# Altium schematic sheet Supply_0_V1_01.SchDoc
size A2; Date: Date; CompanyName: HESSO; Engineer: Name; Address1: Route du Rawyl 47; Address2: 1950 Sion; Address3: Switzerland; ProjectName: Project Name
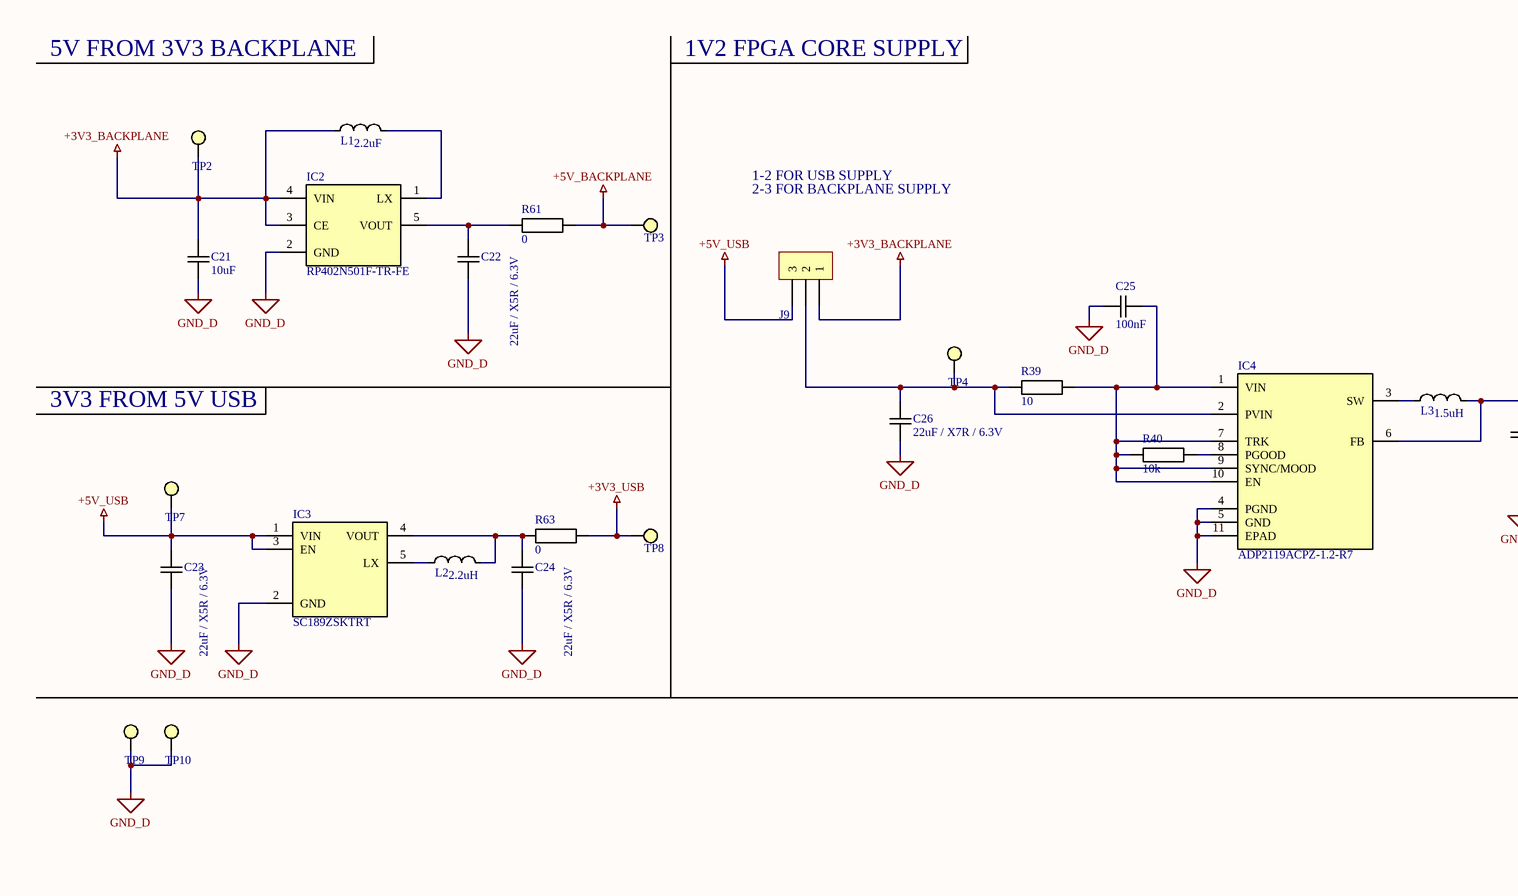
[diagram p0: Supply_0_V1_01.SchDoc, left]
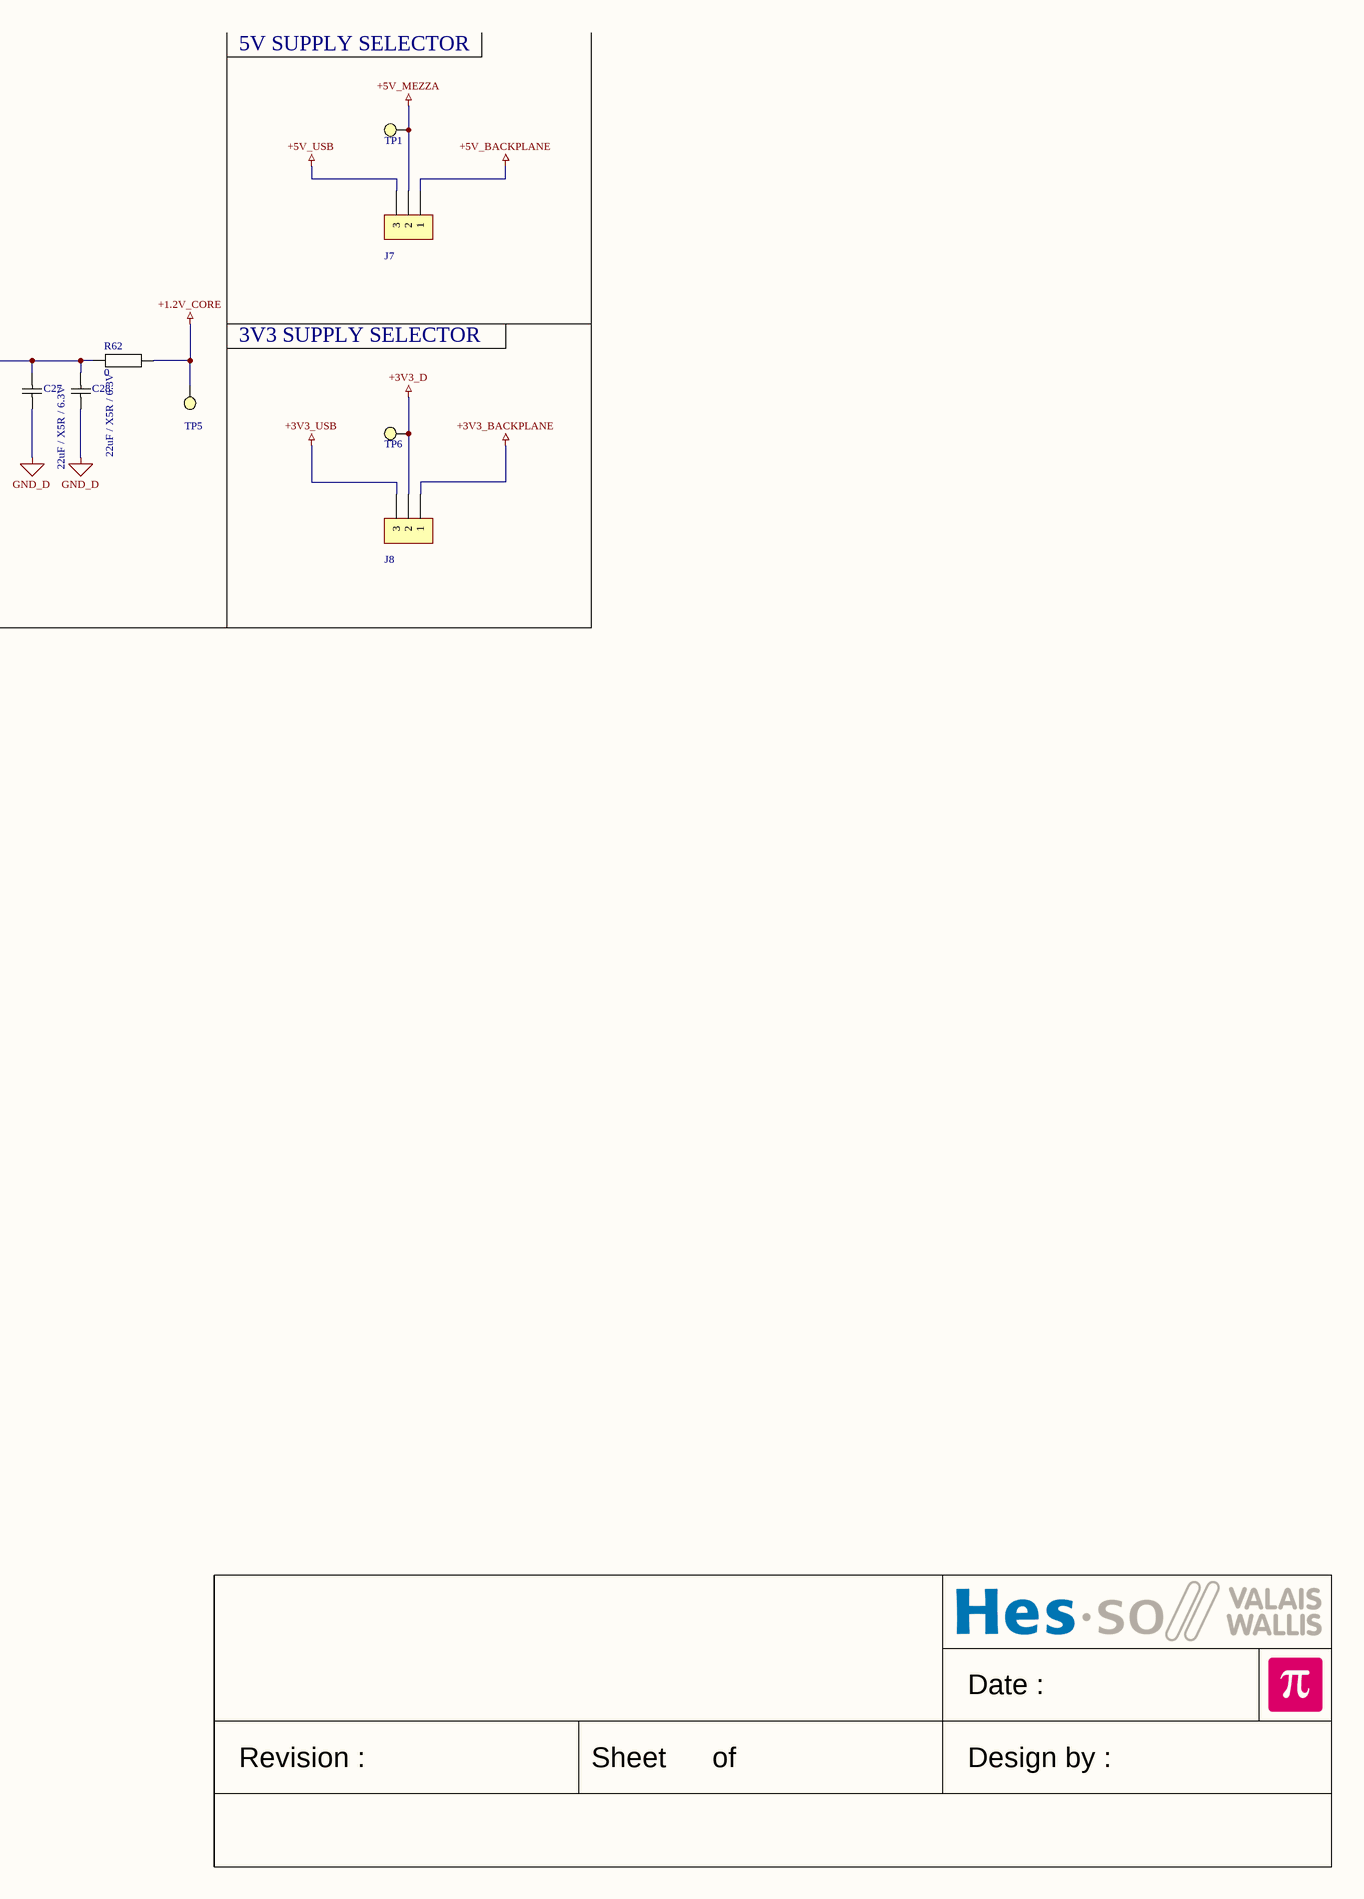
[diagram p1: Supply_0_V1_01.SchDoc, right]

## Parts
C21  10uF  [CAPACITOR 2012 REFLOW]
C22  22uF / X5R / 6.3V  [CAPACITOR 2012 REFLOW]
C23  22uF / X5R / 6.3V  [CAPACITOR 2012 REFLOW]
C24  22uF / X5R / 6.3V  [CAPACITOR 2012 REFLOW]
C25  100nF  [CAPACITOR 1608 REFLOW]
C26  22uF / X7R / 6.3V  [CAPACITOR 2012 REFLOW]
C27  22uF / X5R / 6.3V  [CAPACITOR 2012 REFLOW]
C28  22uF / X5R / 6.3V  [CAPACITOR 2012 REFLOW]
IC2  RP402N501F-TR-FE  [SOT95P280X130-5N]
IC3  SC189ZSKTRT  [SOT95P280X145-5N]
IC4  ADP2119ACPZ-1.2-R7  [SON50P300X300X85-11N]
J7  *  [PinHeader1x3 P2.54]  (value not drawn)
J8  *  [PinHeader1x3 P2.54]  (value not drawn)
J9  *  [PinHeader1x3 P2.54]  (value not drawn)
L1  2.2uF  [TDK VLCF5020-1]
L2  2.2uH  [TDK VLCF5020-1]
L3  1.5uH  [TDK VLCF5020-1]
R39  10  [RESISTOR 2012 REFLOW]
R40  10k  [RESISTOR 1608 REFLOW]
R61  0  [RESISTOR 1608 REFLOW]
R62  0  [RESISTOR 1608 REFLOW]
R63  0  [RESISTOR 1608 REFLOW]
TP1  *  [Test Point Keystone Miniature RED]  (value not drawn)
TP2  *  [Test Point Keystone Miniature RED]  (value not drawn)
TP3  *  [Test Point Keystone Miniature RED]  (value not drawn)
TP4  *  [Test Point Keystone Miniature RED]  (value not drawn)
TP5  *  [Test Point Keystone Miniature RED]  (value not drawn)
TP6  *  [Test Point Keystone Miniature RED]  (value not drawn)
TP7  *  [Test Point Keystone Miniature RED]  (value not drawn)
TP8  *  [Test Point Keystone Miniature RED]  (value not drawn)
TP9  *  [Test Point Keystone Miniature BLACK]  (value not drawn)
TP10  *  [Test Point Keystone Miniature BLACK]  (value not drawn)

## Nets
+1.2V_CORE: R62.2 TP5.1
+3V3_BACKPLANE: C21.2 IC2.3(CE) IC2.4(VIN) J8.1 J9.1 L1.1 TP2.1
+3V3_D: J8.2 TP6.1
+3V3_USB: J8.3 R63.2 TP8.1
+5V_BACKPLANE: J7.1 R61.2 TP3.1
+5V_MEZZA: J7.2 TP1.1
+5V_USB: C23.2 IC3.1(VIN) IC3.3(EN) J7.3 J9.3 TP7.1
GND_D: C21.1 C22.1 C23.1 C24.1 C25.2 C26.1 C27.1 C28.1 IC2.2(GND) IC3.2(GND) IC4.4(PGND) IC4.5(GND) IC4.11(EPAD) TP9.1 TP10.1
NetC22_2: C22.2 IC2.5(VOUT) R61.1
NetC24_2: C24.2 IC3.4(VOUT) L2.2 R63.1
NetC25_1: C25.1 IC4.1(VIN) IC4.7(TRK) IC4.9(SYNC/MOOD) IC4.10(EN) R39.1 R40.2
NetC26_2: C26.2 IC4.2(PVIN) J9.2 R39.2 TP4.1
NetC27_2: C27.2 C28.2 IC4.6(FB) L3.2 R62.1
NetIC2_1: IC2.1(LX) L1.2
NetIC3_5: IC3.5(LX) L2.1
NetIC4_3: IC4.3(SW) L3.1
NetIC4_8: IC4.8(PGOOD) R40.1

## Notes on the sheet
- 5V FROM 3V3 BACKPLANE
- 1V2 FPGA CORE SUPPLY
- 5V SUPPLY SELECTOR
- 1-2 FOR USB SUPPLY
- 2-3 FOR BACKPLANE SUPPLY
- 3V3 SUPPLY SELECTOR
- 3V3 FROM 5V USB
- Date :
- Revision :
- Sheet
- of
- Design by :

## Library data of the parts
C21-C28 = Capacitor
  C21: Value: 10uF
  C22-C24 C27 C28: Value: 22uF / X5R / 6.3V
  C25: Value: 100nF
  C26: Value: 22uF / X7R / 6.3V
IC2 = RP402N501F-TR-FE: Integrated Circuit; Manufacturer_Name: Ricoh; Datasheet Link: https://www.arrow.com/en/products/rp402n501f-tr-fe/ricoh-electronic-devices-company; Height: 1.3mm; Manufacturer_Part_Number: RP402N501F-TR-FE; Mouser Part Number: 848-RP402N501F-TR-FE; Mouser Price/Stock: https://www.mouser.co.uk/ProductDetail/Ricoh-Electronic-Devices-Company/RP402N501F-TR-FE?qs=ilL34mSzaLj3p4B9FaWLxQ%3D%3D; Arrow Part Number: RP402N501F-TR-FE; Arrow Price/Stock: https://www.arrow.com/en/products/rp402n501f-tr-fe/ricoh-electronic-devices-company
IC3 = SC189ZSKTRT: Integrated Circuit; Manufacturer_Name: SEMTECH; Datasheet Link: http://www.semtech.com/images/datasheet/sc189.pdf; Height: 1.45mm; Manufacturer_Part_Number: SC189ZSKTRT; Mouser Part Number: 947-SC189ZSKTRT; Mouser Price/Stock: https://www.mouser.co.uk/ProductDetail/Semtech/SC189ZSKTRT/?qs=rBWM4%252BvDhIck0D%2FgoUNMIQ%3D%3D; Arrow Part Number: SC189ZSKTRT; Arrow Price/Stock: https://www.arrow.com/en/products/sc189zsktrt/semtech
IC4 = ADP2119ACPZ-1.2-R7: Integrated Circuit; Manufacturer_Name: Analog Devices; Manufacturer_Part_Number: ADP2119ACPZ-1.2-R7; Mouser Part Number: 584-ADP2119ACPZ1.2R7; Mouser Price/Stock: https://www.mouser.co.uk/ProductDetail/Analog-Devices/ADP2119ACPZ-12-R7?qs=WIvQP4zGanjkVnaXN%2F8Aww%3D%3D; Arrow Part Number: ADP2119ACPZ-1.2-R7; Arrow Price/Stock: https://www.arrow.com/en/products/adp2119acpz-1.2-r7/analog-devices
J7-J9 = PinHeader1x3: Plug connector; Value: *
L1 = Inductor: Name: NRS5020T2R2NMGJ; Value: 2.2uF
L2 = Inductor: Name: 74437334022; Value: 2.2uH
L3 = Inductor: Name: 74437334015; Value: 1.5uH
R39 R40 = Resistor: Resistor 1% 50V 125mW 2012(0805)
  R39: Value: 10
  R40: Value: 10k
R61-R63 = Resistor: Resistor 1% 50V 100mW 1608(0603); Value: 0
TP1-TP10 = Test Point: Value: *